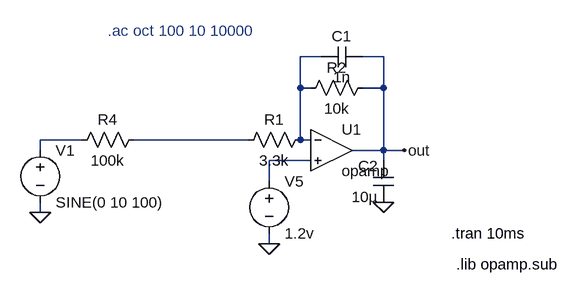
[diagram p0: schematic inputAudioSchematic.asc]
inputAudioSchematic.asc, the LTspice schematic file:
Version 4
SHEET 1 952 688
WIRE 464 176 432 176
WIRE 560 176 528 176
WIRE 432 224 432 176
WIRE 448 224 432 224
WIRE 560 224 560 176
WIRE 560 224 528 224
WIRE 96 304 32 304
WIRE 352 304 176 304
WIRE 432 304 432 224
WIRE 448 304 432 304
WIRE 32 320 32 304
WIRE 560 320 560 224
WIRE 560 320 512 320
WIRE 592 320 560 320
WIRE 448 336 384 336
WIRE 560 336 560 320
WIRE 384 368 384 336
WIRE 32 416 32 400
WIRE 384 464 384 448
FLAG 32 416 0
FLAG 384 464 0
FLAG 592 320 out
FLAG 560 400 0
SYMBOL voltage 32 304 R0
SYMATTR InstName V1
SYMATTR Value SINE(0 10 100)
SYMBOL voltage 384 352 R0
SYMATTR InstName V5
SYMATTR Value 1.2v
SYMBOL res 448 288 R90
WINDOW 0 0 56 VBottom 2
WINDOW 3 32 56 VTop 2
SYMATTR InstName R1
SYMATTR Value 3.3k
SYMBOL res 544 208 R90
WINDOW 0 0 56 VBottom 2
WINDOW 3 32 56 VTop 2
SYMATTR InstName R2
SYMATTR Value 10k
SYMBOL Opamps/opamp 480 256 R0
SYMATTR InstName U1
SYMBOL cap 528 160 R90
WINDOW 0 0 32 VBottom 2
WINDOW 3 32 32 VTop 2
SYMATTR InstName C1
SYMATTR Value 1n
SYMBOL cap 576 400 R180
WINDOW 0 24 56 Left 2
WINDOW 3 24 8 Left 2
SYMATTR InstName C2
SYMATTR Value 10µ
SYMBOL res 192 288 R90
WINDOW 0 0 56 VBottom 2
WINDOW 3 32 56 VTop 2
SYMATTR InstName R4
SYMATTR Value 100k
TEXT 664 448 Left 2 !.tran 10ms
TEXT 672 496 Left 2 !.lib opamp.sub
TEXT 136 136 Left 2 ;.ac oct 100 10 10000

The netlist it stands for:
* inputAudioSchematic.asc
V1 N002 0 SINE(0 10 100)
V5 N004 0 1.2v
R1 N001 N003 3.3k
R2 out N001 10k
XU1 N001 N004 out opamp Aol=100K GBW=10Meg  ; pins invin noninvin out
C1 out N001 1n
C2 0 out 10µ
R4 N003 N002 100k
.tran 10ms
.lib opamp.sub
* .ac oct 100 10 10000
.backanno
.end